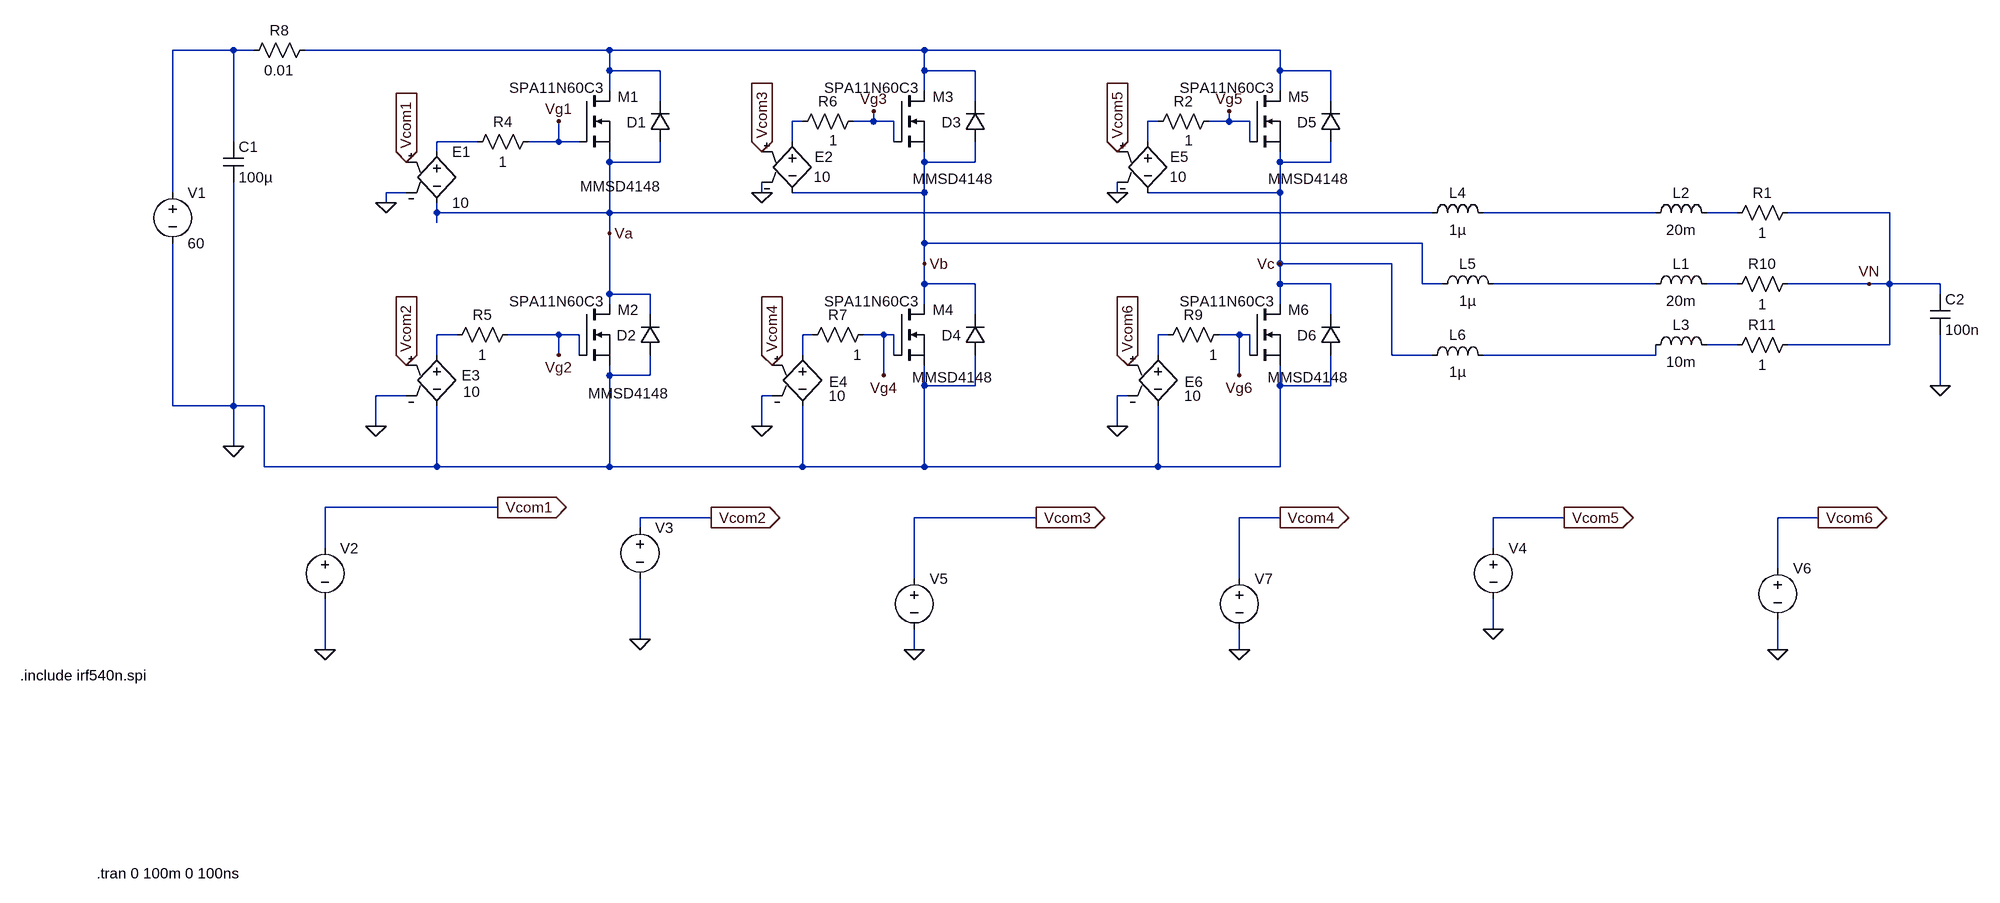
[diagram p0: schematic three_phase_vsi_ltspice_model.asc]
three_phase_vsi_ltspice_model.asc, the LTspice schematic file:
Version 4.1
SHEET 1 2408 1368
WIRE -416 -48 -512 -48
WIRE -384 -48 -416 -48
WIRE 176 -48 -304 -48
WIRE 672 -48 176 -48
WIRE 1232 -48 672 -48
WIRE 176 -16 176 -48
WIRE 256 -16 176 -16
WIRE 672 -16 672 -48
WIRE 752 -16 672 -16
WIRE 1232 -16 1232 -48
WIRE 1312 -16 1232 -16
WIRE 176 16 176 -16
WIRE 672 16 672 -16
WIRE 1232 16 1232 -16
WIRE 256 32 256 -16
WIRE 752 32 752 -16
WIRE 1312 32 1312 -16
WIRE 480 64 464 64
WIRE 592 64 592 48
WIRE 592 64 560 64
WIRE 624 64 592 64
WIRE 1040 64 1024 64
WIRE 1152 64 1152 48
WIRE 1152 64 1120 64
WIRE 1184 64 1152 64
WIRE -416 96 -416 -48
WIRE -32 96 -96 96
WIRE 96 96 96 64
WIRE 96 96 48 96
WIRE 128 96 96 96
WIRE 464 96 464 64
WIRE 624 96 624 64
WIRE 1024 96 1024 64
WIRE 1184 96 1184 64
WIRE -96 112 -96 96
WIRE 176 128 176 112
WIRE 256 128 256 96
WIRE 256 128 176 128
WIRE 672 128 672 112
WIRE 752 128 752 96
WIRE 752 128 672 128
WIRE 1232 128 1232 112
WIRE 1312 128 1312 96
WIRE 1312 128 1232 128
WIRE -512 176 -512 -48
WIRE -144 176 -176 176
WIRE 416 176 416 160
WIRE 672 176 672 128
WIRE 672 176 464 176
WIRE 976 176 976 160
WIRE 1232 176 1232 128
WIRE 1232 176 1024 176
WIRE -176 192 -176 176
WIRE -96 208 -96 192
WIRE 176 208 176 128
WIRE 176 208 -96 208
WIRE 1472 208 176 208
WIRE 1824 208 1552 208
WIRE 1952 208 1904 208
WIRE 2192 208 2032 208
WIRE -96 224 -96 208
WIRE 176 240 176 208
WIRE 672 256 672 176
WIRE 1456 256 672 256
WIRE 672 288 672 256
WIRE 1232 288 1232 176
WIRE 1408 288 1232 288
WIRE 672 320 672 288
WIRE 752 320 672 320
WIRE 1232 320 1232 288
WIRE 1312 320 1232 320
WIRE 1456 320 1456 256
WIRE 1488 320 1456 320
WIRE 1824 320 1568 320
WIRE 1952 320 1904 320
WIRE 2160 320 2032 320
WIRE 2192 320 2192 208
WIRE 2192 320 2160 320
WIRE 2272 320 2192 320
WIRE 176 336 176 240
WIRE 240 336 176 336
WIRE 2272 336 2272 320
WIRE 176 352 176 336
WIRE 672 352 672 320
WIRE 1232 352 1232 320
WIRE 240 368 240 336
WIRE 752 368 752 320
WIRE 1312 368 1312 320
WIRE -64 400 -96 400
WIRE 96 400 16 400
WIRE 128 400 96 400
WIRE 496 400 480 400
WIRE 608 400 576 400
WIRE 624 400 608 400
WIRE 1056 400 1040 400
WIRE 1168 400 1136 400
WIRE 1184 400 1168 400
WIRE 1952 416 1904 416
WIRE 2192 416 2192 320
WIRE 2192 416 2032 416
WIRE -96 432 -96 400
WIRE 96 432 96 400
WIRE 128 432 128 400
WIRE 480 432 480 400
WIRE 624 432 624 400
WIRE 1040 432 1040 400
WIRE 1184 432 1184 400
WIRE 1408 432 1408 288
WIRE 1472 432 1408 432
WIRE 1824 432 1824 416
WIRE 1824 432 1552 432
WIRE 176 464 176 448
WIRE 240 464 240 432
WIRE 240 464 176 464
WIRE 608 464 608 400
WIRE 1168 464 1168 400
WIRE 672 480 672 448
WIRE 752 480 752 432
WIRE 752 480 672 480
WIRE 1232 480 1232 448
WIRE 1312 480 1312 432
WIRE 1312 480 1232 480
WIRE 2272 480 2272 400
WIRE -144 496 -192 496
WIRE 432 496 416 496
WIRE 992 496 976 496
WIRE -512 512 -512 256
WIRE -416 512 -416 160
WIRE -416 512 -512 512
WIRE -368 512 -416 512
WIRE -192 544 -192 496
WIRE 416 544 416 496
WIRE 976 544 976 496
WIRE -416 576 -416 512
WIRE -368 608 -368 512
WIRE -96 608 -96 512
WIRE -96 608 -368 608
WIRE 176 608 176 464
WIRE 176 608 -96 608
WIRE 480 608 480 512
WIRE 480 608 176 608
WIRE 672 608 672 480
WIRE 672 608 480 608
WIRE 1040 608 1040 512
WIRE 1040 608 672 608
WIRE 1232 608 1232 480
WIRE 1232 608 1040 608
WIRE 0 672 -272 672
WIRE 336 688 224 688
WIRE 848 688 656 688
WIRE 1232 688 1168 688
WIRE 1680 688 1568 688
WIRE 2080 688 2016 688
WIRE 224 704 224 688
WIRE -272 736 -272 672
WIRE 1568 736 1568 688
WIRE 2016 768 2016 688
WIRE 656 784 656 688
WIRE 1168 784 1168 688
WIRE 1568 864 1568 816
WIRE 224 880 224 784
WIRE -272 896 -272 816
WIRE 656 896 656 864
WIRE 1168 896 1168 864
WIRE 2016 896 2016 848
FLAG -144 128 Vcom1
IOPIN -144 128 In
FLAG 416 112 Vcom3
IOPIN 416 112 In
FLAG 416 176 0
FLAG -176 192 0
FLAG -144 448 Vcom2
IOPIN -144 448 In
FLAG 432 448 Vcom4
IOPIN 432 448 In
FLAG 176 240 Va
FLAG 672 288 Vb
FLAG 0 672 Vcom1
IOPIN 0 672 Out
FLAG 336 688 Vcom2
IOPIN 336 688 Out
FLAG 96 432 Vg2
FLAG 592 48 Vg3
FLAG 608 464 Vg4
FLAG 96 64 Vg1
FLAG 976 112 Vcom5
IOPIN 976 112 In
FLAG 976 176 0
FLAG 992 448 Vcom6
IOPIN 992 448 In
FLAG 1232 288 Vc
FLAG 1152 48 Vg5
FLAG 1168 464 Vg6
FLAG -272 896 0
FLAG 848 688 Vcom3
IOPIN 848 688 Out
FLAG 1232 688 Vcom4
IOPIN 1232 688 Out
FLAG 1680 688 Vcom5
IOPIN 1680 688 Out
FLAG 2080 688 Vcom6
IOPIN 2080 688 Out
FLAG 2160 320 VN
FLAG 224 880 0
FLAG 656 896 0
FLAG 1168 896 0
FLAG 1568 864 0
FLAG 2016 896 0
FLAG -192 544 0
FLAG 416 544 0
FLAG 976 544 0
FLAG -416 576 0
FLAG 2272 480 0
SYMBOL voltage -512 160 R0
WINDOW 123 0 0 Left 2
WINDOW 39 0 0 Left 2
SYMATTR InstName V1
SYMATTR Value 60
SYMBOL nmos 128 16 R0
WINDOW 0 61 9 Left 2
WINDOW 3 -110 -5 Left 2
SYMATTR InstName M1
SYMATTR Value SPA11N60C3
SYMBOL res 64 80 R90
WINDOW 0 0 56 VBottom 2
WINDOW 3 32 56 VTop 2
SYMATTR InstName R4
SYMATTR Value 1
SYMBOL res 32 384 R90
WINDOW 0 0 56 VBottom 2
WINDOW 3 32 56 VTop 2
SYMATTR InstName R5
SYMATTR Value 1
SYMBOL res 576 48 R90
WINDOW 0 0 56 VBottom 2
WINDOW 3 30 47 VTop 2
SYMATTR InstName R6
SYMATTR Value 1
SYMBOL res 592 384 R90
WINDOW 0 0 56 VBottom 2
WINDOW 3 32 25 VTop 2
SYMATTR InstName R7
SYMATTR Value 1
SYMBOL res -288 -64 R90
WINDOW 0 0 56 VBottom 2
WINDOW 3 32 56 VTop 2
SYMATTR InstName R8
SYMATTR Value 0.01
SYMBOL e -96 96 R0
SYMATTR InstName E1
SYMATTR Value 10
SYMBOL e 464 80 R0
WINDOW 0 35 40 Left 2
WINDOW 3 34 71 Left 2
SYMATTR InstName E2
SYMATTR Value 10
SYMBOL e -96 416 R0
WINDOW 0 39 48 Left 2
WINDOW 3 42 74 Left 2
SYMATTR InstName E3
SYMATTR Value 10
SYMBOL e 480 416 R0
WINDOW 0 42 58 Left 2
WINDOW 3 41 80 Left 2
SYMATTR InstName E4
SYMATTR Value 10
SYMBOL diode 272 96 R180
WINDOW 0 38 31 Left 2
WINDOW 3 15 -70 Left 2
SYMATTR InstName D1
SYMATTR Value MMSD4148
SYMBOL ind 1808 224 R270
WINDOW 0 32 56 VTop 2
WINDOW 3 5 56 VBottom 2
SYMATTR InstName L2
SYMATTR Value 20m
SYMBOL nmos 128 352 R0
WINDOW 0 61 9 Left 2
WINDOW 3 -110 -5 Left 2
SYMATTR InstName M2
SYMATTR Value SPA11N60C3
SYMBOL nmos 624 16 R0
WINDOW 0 61 9 Left 2
WINDOW 3 -110 -5 Left 2
SYMATTR InstName M3
SYMATTR Value SPA11N60C3
SYMBOL nmos 624 352 R0
WINDOW 0 61 9 Left 2
WINDOW 3 -110 -5 Left 2
SYMATTR InstName M4
SYMATTR Value SPA11N60C3
SYMBOL diode 256 432 R180
WINDOW 0 38 31 Left 2
WINDOW 3 -14 -60 Left 2
SYMATTR InstName D2
SYMATTR Value MMSD4148
SYMBOL diode 768 96 R180
WINDOW 0 38 31 Left 2
WINDOW 3 -13 -58 Left 2
SYMATTR InstName D3
SYMATTR Value MMSD4148
SYMBOL diode 768 432 R180
WINDOW 0 38 31 Left 2
WINDOW 3 -12 -35 Left 2
SYMATTR InstName D4
SYMATTR Value MMSD4148
SYMBOL res 1136 48 R90
WINDOW 0 0 56 VBottom 2
WINDOW 3 30 47 VTop 2
SYMATTR InstName R2
SYMATTR Value 1
SYMBOL res 1152 384 R90
WINDOW 0 0 56 VBottom 2
WINDOW 3 32 25 VTop 2
SYMATTR InstName R9
SYMATTR Value 1
SYMBOL e 1024 80 R0
WINDOW 0 35 40 Left 2
WINDOW 3 34 71 Left 2
SYMATTR InstName E5
SYMATTR Value 10
SYMBOL e 1040 416 R0
WINDOW 0 42 58 Left 2
WINDOW 3 41 80 Left 2
SYMATTR InstName E6
SYMATTR Value 10
SYMBOL nmos 1184 16 R0
WINDOW 0 61 9 Left 2
WINDOW 3 -110 -5 Left 2
SYMATTR InstName M5
SYMATTR Value SPA11N60C3
SYMBOL nmos 1184 352 R0
WINDOW 0 61 9 Left 2
WINDOW 3 -110 -5 Left 2
SYMATTR InstName M6
SYMATTR Value SPA11N60C3
SYMBOL diode 1328 96 R180
WINDOW 0 38 31 Left 2
WINDOW 3 -13 -58 Left 2
SYMATTR InstName D5
SYMATTR Value MMSD4148
SYMBOL diode 1328 432 R180
WINDOW 0 38 31 Left 2
WINDOW 3 -12 -35 Left 2
SYMATTR InstName D6
SYMATTR Value MMSD4148
SYMBOL res 2048 192 R90
WINDOW 0 0 56 VBottom 2
WINDOW 3 32 56 VTop 2
SYMATTR InstName R1
SYMATTR Value 1
SYMBOL res 2048 304 R90
WINDOW 0 0 56 VBottom 2
WINDOW 3 32 56 VTop 2
SYMATTR InstName R10
SYMATTR Value 1
SYMBOL res 2048 400 R90
WINDOW 0 0 56 VBottom 2
WINDOW 3 32 56 VTop 2
SYMATTR InstName R11
SYMATTR Value 1
SYMBOL ind 1808 336 R270
WINDOW 0 32 56 VTop 2
WINDOW 3 5 56 VBottom 2
SYMATTR InstName L1
SYMATTR Value 20m
SYMBOL ind 1808 432 R270
WINDOW 0 32 56 VTop 2
WINDOW 3 5 56 VBottom 2
SYMATTR InstName L3
SYMATTR Value 10m
SYMBOL cap -432 96 R0
SYMATTR InstName C1
SYMATTR Value 100µ
SYMBOL ind 1456 224 R270
WINDOW 0 32 56 VTop 2
WINDOW 3 5 56 VBottom 2
SYMATTR InstName L4
SYMATTR Value 1µ
SYMBOL ind 1472 336 R270
WINDOW 0 32 56 VTop 2
WINDOW 3 5 56 VBottom 2
SYMATTR InstName L5
SYMATTR Value 1µ
SYMBOL ind 1456 448 R270
WINDOW 0 32 56 VTop 2
WINDOW 3 5 56 VBottom 2
SYMATTR InstName L6
SYMATTR Value 1µ
SYMBOL voltage -272 720 R0
WINDOW 123 0 0 Left 0
WINDOW 39 0 0 Left 0
WINDOW 3 24 96 Invisible 2
SYMATTR Value PWL file="C:\Users\imaka\OneDrive\Desktop\Research\LT Spice Model\LTSpice_SVPWM\Version1\100ms\gate_S1.txt"
SYMATTR InstName V2
SYMBOL voltage 224 688 R0
WINDOW 123 0 0 Left 0
WINDOW 39 0 0 Left 0
WINDOW 3 24 96 Invisible 2
SYMATTR Value PWL file="C:\Users\imaka\OneDrive\Desktop\Research\LT Spice Model\LTSpice_SVPWM\Version1\100ms\gate_S2.txt"
SYMATTR InstName V3
SYMBOL voltage 1568 720 R0
WINDOW 123 0 0 Left 0
WINDOW 39 0 0 Left 0
WINDOW 3 24 96 Invisible 2
SYMATTR Value PWL file="C:\Users\imaka\OneDrive\Desktop\Research\LT Spice Model\LTSpice_SVPWM\Version1\100ms\gate_S5.txt"
SYMATTR InstName V4
SYMBOL voltage 656 768 R0
WINDOW 123 0 0 Left 0
WINDOW 39 0 0 Left 0
WINDOW 3 24 96 Invisible 2
SYMATTR Value PWL file="C:\Users\imaka\OneDrive\Desktop\Research\LT Spice Model\LTSpice_SVPWM\Version1\100ms\gate_S3.txt"
SYMATTR InstName V5
SYMBOL voltage 2016 752 R0
WINDOW 123 0 0 Left 0
WINDOW 39 0 0 Left 0
WINDOW 3 24 96 Invisible 2
SYMATTR Value PWL file="C:\Users\imaka\OneDrive\Desktop\Research\LT Spice Model\LTSpice_SVPWM\Version1\100ms\gate_S6.txt"
SYMATTR InstName V6
SYMBOL voltage 1168 768 R0
WINDOW 123 0 0 Left 0
WINDOW 39 0 0 Left 0
WINDOW 3 24 96 Invisible 2
SYMATTR Value PWL file="C:\Users\imaka\OneDrive\Desktop\Research\LT Spice Model\LTSpice_SVPWM\Version1\100ms\gate_S4.txt"
SYMATTR InstName V7
SYMBOL cap 2256 336 R0
SYMATTR InstName C2
SYMATTR Value 100n
TEXT -632 1248 Left 2 !.tran 0 100m 0 100ns
TEXT -752 936 Left 2 !.include irf540n.spi

The netlist it stands for:
* three_phase_vsi_ltspice_model.asc
V1 N001 0 60
M1 N002 Vg1 Va Va SPA11N60C3
R4 Vg1 N005 1
R5 Vg2 N010 1
R6 Vg3 N003 1
R7 Vg4 N011 1
R8 N002 N001 0.01
E1 N005 Va Vcom1 0 10
E2 N003 Vb Vcom3 0 10
E3 N010 0 Vcom2 0 10
E4 N011 0 Vcom4 0 10
D1 Va N002 MMSD4148
L2 N006 N007 20m
M2 Va Vg2 0 0 SPA11N60C3
M3 N002 Vg3 Vb Vb SPA11N60C3
M4 Vb Vg4 0 0 SPA11N60C3
D2 0 Va MMSD4148
D3 Vb N002 MMSD4148
D4 0 Vb MMSD4148
R2 Vg5 N004 1
R9 Vg6 N012 1
E5 N004 Vc Vcom5 0 10
E6 N012 0 Vcom6 0 10
M5 N002 Vg5 Vc Vc SPA11N60C3
M6 Vc Vg6 0 0 SPA11N60C3
D5 Vc N002 MMSD4148
D6 0 Vc MMSD4148
R1 VN N007 1
R10 VN N009 1
R11 VN N013 1
L1 N008 N009 20m
L3 N014 N013 10m
C1 N001 0 100µ
L4 Va N006 1µ
L5 Vb N008 1µ
L6 Vc N014 1µ
V2 Vcom1 0 PWL file="C:\Users\imaka\OneDrive\Desktop\Research\LT Spice Model\LTSpice_SVPWM\Version1\100ms\gate_S1.txt"
V3 Vcom2 0 PWL file="C:\Users\imaka\OneDrive\Desktop\Research\LT Spice Model\LTSpice_SVPWM\Version1\100ms\gate_S2.txt"
V4 Vcom5 0 PWL file="C:\Users\imaka\OneDrive\Desktop\Research\LT Spice Model\LTSpice_SVPWM\Version1\100ms\gate_S5.txt"
V5 Vcom3 0 PWL file="C:\Users\imaka\OneDrive\Desktop\Research\LT Spice Model\LTSpice_SVPWM\Version1\100ms\gate_S3.txt"
V6 Vcom6 0 PWL file="C:\Users\imaka\OneDrive\Desktop\Research\LT Spice Model\LTSpice_SVPWM\Version1\100ms\gate_S6.txt"
V7 Vcom4 0 PWL file="C:\Users\imaka\OneDrive\Desktop\Research\LT Spice Model\LTSpice_SVPWM\Version1\100ms\gate_S4.txt"
C2 VN 0 100n
.model D D
.lib standard.dio
.model NMOS NMOS
.model PMOS PMOS
.lib standard.mos
.tran 0 100m 0 100ns
.include irf540n.spi
.backanno
.end